# EAGLE design air-line-7-17-32 (EAGLE 9.5.0)
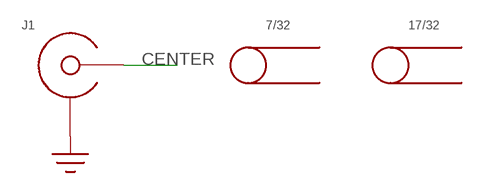
[diagram p0: schematic, sheet 1]

## Parts
J1  SMA-EDGE-LAUNCH4020_TAPER  [SMA_EDGE_LAUNCH_2L_4020_TAPER]
U$2  7/32  TUBE7/32  [TUBE-7/32]
U$3  17/32  TUBE17/32  [TUBE-17/32]

## Nets
CENTER: J1.CENTER@1(CENTER)
GND: J1.BOTTOM_GND(SHIELD) J1.GND@1(SHIELD) J1.GND@2(SHIELD) J1.GND@3(SHIELD) J1.GND@4(SHIELD) J1.GND@5(SHIELD) J1.GND@6(SHIELD) J1.GND@7(SHIELD) J1.GND@8(SHIELD) J1.GND@14(SHIELD) J1.GND@15(SHIELD) J1.GND@16(SHIELD) J1.GND@17(SHIELD) J1.GND_PAD1(SHIELD) J1.GND_PAD2(SHIELD) J1.P$1(SHIELD) J1.P$2(SHIELD)

## Library data of the parts
J1 = yapo:SMA-EDGE-LAUNCH
U$2 U$3 = yapo:TUBE

## Board
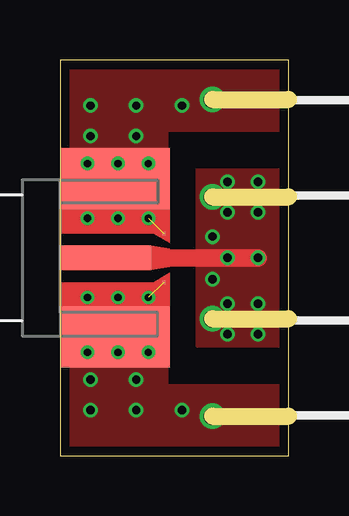
[diagram p1: board, top side]
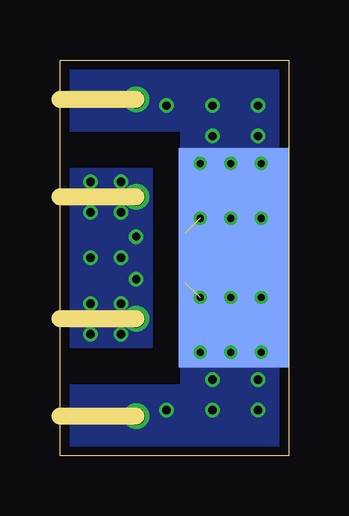
[diagram p2: board, bottom side, seen from below]

Size 9.53 x 16.51 mm. Coordinates in mm from the lower left corner, seen from the top.
Outline: 0,0 9.53,0 9.53,16.51 0,16.51 0,0
Copper layers (1*16): Top 0.035559375mm / dielectric 1.6mm / Bottom 0.035559375mm
Design rules "oshpark-2layer *": minimum track width 6mil, minimum drill 10mil, track to track 6mil, track to pad 6mil, pad to pad 6mil, via to via 6mil, smd to smd 6mil, copper to edge 15mil, drill to drill 6mil, minimum pad ring 5mil, minimum via ring 5mil, stop-mask expansion 2.5mil, vias tented up to drill 20mil, thermal gap 10mil
Milling: 4 lines

### Footprints (pad centres in the part's own frame; a part is rotated, then mirrored left to right if it is on the bottom)
SMA_EDGE_LAUNCH_2L_4020_TAPER = smd 4.572 x 9.144 bottom: BOTTOM_GND 2.286,0 | smd 3.81 x 1.016: CENTER@1 1.905,0 | drill 0.3: GND@1 1.143,3.937; GND@2 3.683,3.937; GND@3 1.143,1.651; GND@4 3.683,1.651; GND@5 1.143,-1.651; GND@6 3.683,-1.651; GND@7 1.143,-3.937; GND@8 3.683,-3.937; GND@14 2.413,3.937; GND@15 2.413,-3.937; GND@16 2.413,-1.651; GND@17 2.413,1.651 | smd 4.572 x 2.54: GND_PAD1 2.286,3.302; GND_PAD2 2.286,-3.302 | smd 0.127 x 0.127: P$1 4.318,1.016; P$2 4.318,-1.016

### Placement (x,y rotation side)
J1  0,8.26 0 top
U$2  6.35,8.26 0 top
U$3  6.35,8.26 0 top

### Tracks (layer width: path | path; a pad name or v marks a point on that pad's centre or on a via)
CENTER  (via drill 0.35, 0.71 pad 0.91)
  Top 0.737: J1.CENTER@1 v6.99,8.26 v8.26,8.26
  other vias: 6.99,10.16 8.26,10.16 6.99,6.35 8.26,6.35 6.35,10.79 6.35,5.71 6.35,9.14 6.35,7.37 6.99,11.43 8.26,11.43 8.26,5.08 6.99,5.08
  pour Top: 5.71,11.94 9.53,11.94 9.53,4.57 5.71,4.57
  pour Bottom: 5.71,4.57 5.71,11.94 9.53,11.94 9.53,4.57
GND  (via drill 0.35, 0.71 pad 0.91)  (2 unrouted)
  other vias: 6.35,14.86 6.35,1.65 1.27,14.61 3.17,14.61 1.27,13.34 3.17,13.34 1.27,3.17 3.17,3.17 3.17,1.91 1.27,1.91 5.08,14.61 5.08,1.91
  pour Top (rank 2, no thermals): 0,0 0,16.51 9.53,16.51 9.53,13.59 4.45,13.59 4.45,2.92 9.53,2.92 9.53,0
  pour Bottom (rank 2, no thermals): 0,0 0,16.51 9.53,16.51 9.53,13.59 4.45,13.59 4.45,2.92 9.53,2.92 9.53,0